# Altium schematic sheet Medicop_Schematic.SchDoc
size A4
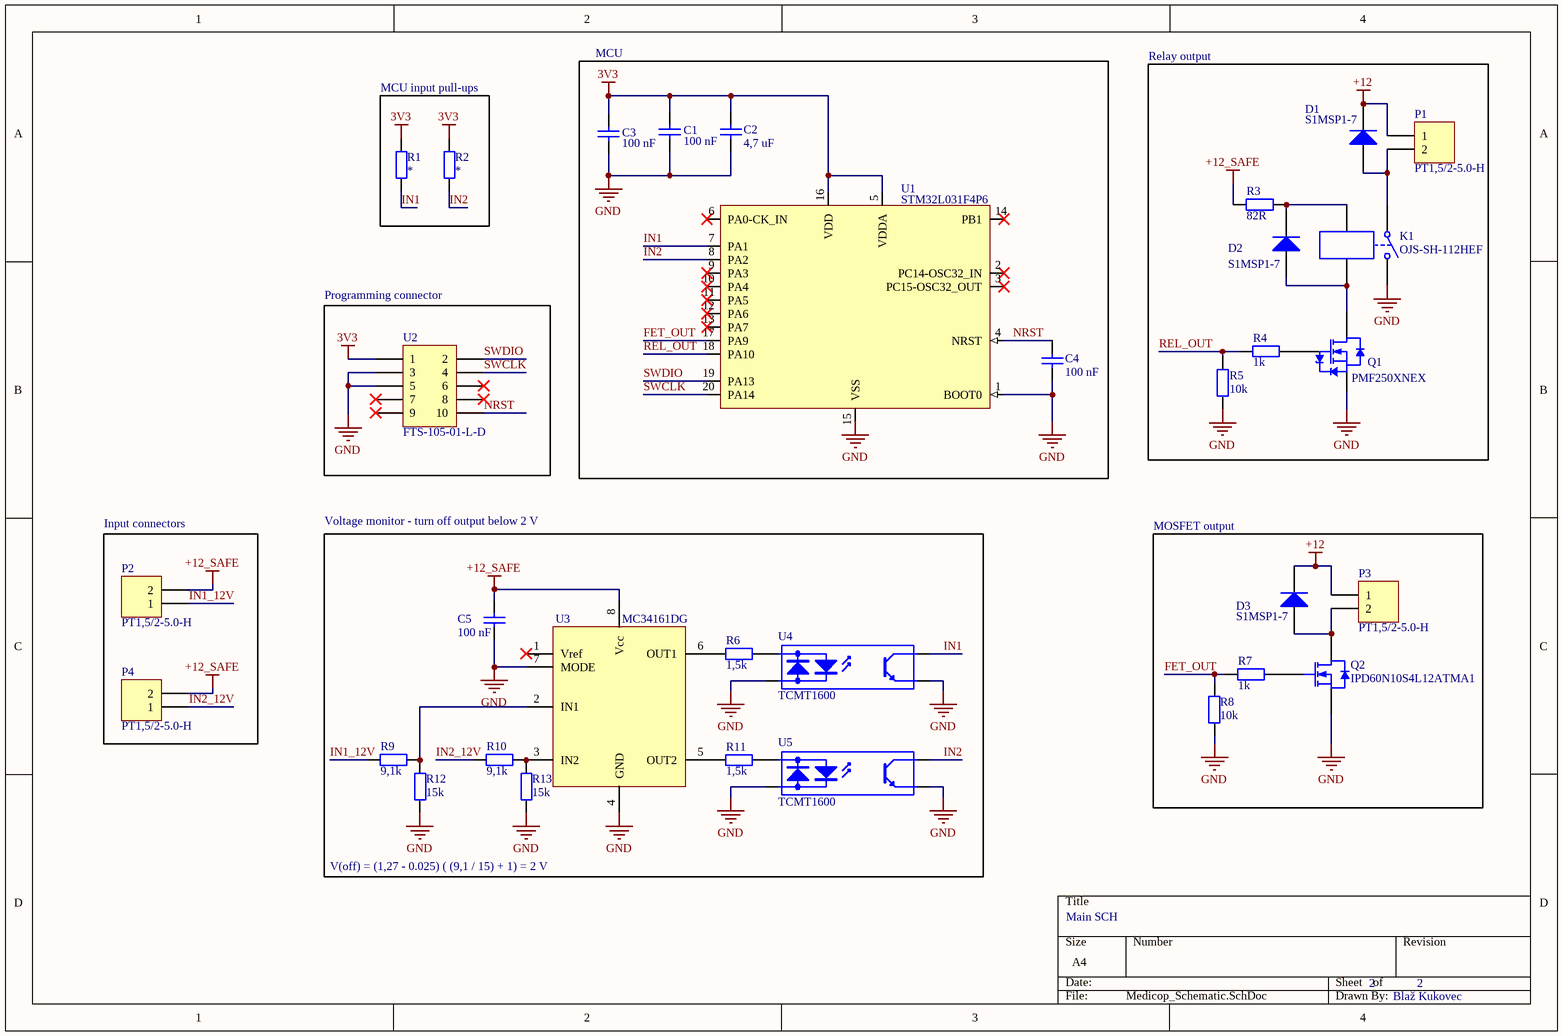
[diagram p0: Medicop_Schematic.SchDoc]

## Parts
C1  value 100 nF  [C0603[1608]]  (hidden comment: Cap)
C2  value 4,7 uF  [C0603[1608]]  (hidden comment: Cap)
C3  value 100 nF  [C0603[1608]]  (hidden comment: Cap)
C4  value 100 nF  [C0603[1608]]  (hidden comment: Cap)
C5  value 100 nF  [C0603[1608]]  (hidden comment: Cap)
D1  S1MSP1-7  [PowerDI123]
D2  S1MSP1-7  [PowerDI123]
D3  S1MSP1-7  [PowerDI123]
K1  OJS-SH-112HEF
P1  PT1,5/2-5.0-H  [PT1,5/2-5.0-H]
P2  PT1,5/2-5.0-H  [PT1,5/2-5.0-H]
P3  PT1,5/2-5.0-H  [PT1,5/2-5.0-H]
P4  PT1,5/2-5.0-H  [PT1,5/2-5.0-H]
Q1  PMF250XNEX  [SC-70 (SOT323)]
Q2  IPD60N10S4L12ATMA1  [DPAK (TO-252)]
R1  Res  [R0603[1608]]  (value not drawn)
R2  Res  [R0603[1608]]  (value not drawn)
R3  value 82R  [R1206[3216]]  (hidden comment: Res)
R4  value 1k  [R0603[1608]]  (hidden comment: Res)
R5  value 10k  [R0603[1608]]  (hidden comment: Res)
R6  value 1,5k  [R1206[3216]]  (hidden comment: Res)
R7  value 1k  [R0603[1608]]  (hidden comment: Res)
R8  value 10k  [R0603[1608]]  (hidden comment: Res)
R9  value 9,1k  [R0603[1608]]  (hidden comment: Res)
R10  value 9,1k  [R0603[1608]]  (hidden comment: Res)
R11  value 1,5k  [R1206[3216]]  (hidden comment: Res)
R12  value 15k  [R0603[1608]]  (hidden comment: Res)
R13  value 15k  [R0603[1608]]  (hidden comment: Res)
U1  STM32L031F4P6  [TSSOP-20]
U2  FTS-105-01-L-D  [CON10_2x5_TU_FTS_SAI]
U3  MC34161DG  [SOIC-8]
U4  TCMT1600  [SOP-4]
U5  TCMT1600  [SOP-4]

## Blocks framed on the sheet
Relay output: D1 D2 K1 P1 Q1 R3-R5
MCU input pull-ups: R1 R2
Programming connector: U2
Input connectors: P2 P4
MOSFET output: D3 P3 Q2 R7 R8

## Nets
3V3: C1.2 C2.2 C3.2 R1.2 R2.2 U1.5(VDDA) U1.16(VDD) U2.1
+12: D1.2(K) D3.2(K) P1.1 P3.1
+12_SAFE: C5.2 P2.2 P4.2 R3.2 U3.8(Vcc)
GND: C1.1 C2.1 C3.1 C4.1 C5.1 K1.2 Q1.2(S) Q2.3(S) R5.1 R8.2 R12.1 R13.1 U1.1(BOOT0) U1.15(VSS) U2.3 U2.5 U3.4(GND) U3.7(MODE) U4.2(K) U4.3(E) U5.2(K) U5.3(E)
FET_OUT: R7.1 R8.1 U1.17(PA9)
IN1: R1.1 U1.7(PA1) U4.4(C)
IN1_12V: P2.1 R9.2
IN2: R2.1 U1.8(PA2) U5.4(C)
IN2_12V: P4.1 R10.2
NRST: C4.2 U1.4(NRST) U2.10
REL_OUT: R4.2 R5.2 U1.18(PA10)
SWCLK: U1.20(PA14) U2.4
SWDIO: U1.19(PA13) U2.2
NetD1_1: D1.1(A) K1.1 P1.2
NetD2_1: D2.1(A) K1.4 Q1.3(D)
NetD2_2: D2.2(K) K1.3 R3.1
NetD3_1: D3.1(A) P3.2 Q2.2(D)
NetQ1_1: Q1.1(G) R4.1
NetQ2_1: Q2.1(G) R7.2
NetR6_1: R6.1 U3.6(OUT1)
NetR6_2: R6.2 U4.1(A)
NetR9_1: R9.1 R12.2 U3.2(IN1)
NetR10_1: R10.1 R13.2 U3.3(IN2)
NetR11_1: R11.1 U3.5(OUT2)
NetR11_2: R11.2 U5.1(A)

Not connected (* = marked no-connect by the designer): U1 2(PC14-OSC32_IN)* 3(PC15-OSC32_OUT)* 6(PA0-CK_IN)* 9(PA3)* 10(PA4)* 11(PA5)* 12(PA6)* 13(PA7)* 14(PB1)*; U2 6* 7* 8* 9*; U3 1(Vref)*

## Notes on the sheet
- MCU
- Voltage monitor - turn off output below 2 V
- V(off) = (1,27 - 0.025) ( (9,1 / 15) + 1) = 2 V
- Main SCH
- 2
- Blaž Kukovec

## Library data of the parts
C1-C5 = Cap: Capacitor; ComponentLink1Description: Supplierlink; ComponentLink2Description: Datasheet
D1-D3 = S1MSP1-7: S1MSP1-7 -  Standard Power Diode; ComponentLink1Description: Supplierlink; PackageDescription: PowerDI123; ComponentLink1URL: http://si.farnell.com/diodes-inc/s1msp1-7/rectifier-single-1kv-1a-powerdi123/dp/2709563?ost=2709563&iscrfnonsku=false&ddkey=http%3Asl-SL%2FElement14_Slovenia%2Fsearch; ComponentLink2Description: Datasheet; ComponentLink2URL: http://www.farnell.com/datasheets/2211407.pdf?_ga=2.218430301.595311603.1510137230-1866036872.1506721459&_gac=1.149546820.1509893228.CjwKCAjw7frPBRBVEiwAuDf_LXlrjw5vBXiuyKtw25GuiPLDKV5cnVdEcFzcF753v9PaBj8Hg6kd-RoC_yYQAvD_BwE; Supplier1: Farnell; SupplierPartNumber1: 2709563
K1 = OJS-SH-112HEF: Power Relay, SPST-NO, 12 VDC, 16 A, OJS, Through Hole, Non Latching; ComponentLink1Description: Supplierlink; PackageDescription: /; ComponentLink1URL: https://si.farnell.com/te-connectivity-oeg/2071556-3/power-relay-spst-no-12vdc-16a/dp/3764768; ComponentLink2Description: Datasheet; ComponentLink2URL: https://www.farnell.com/datasheets/3212368.pdf; Supplier1: Farnell; SupplierPartNumber1: 3764768
P1-P4 = PT1,5/2-5.0-H: Wire-To-Board Terminal Block, 5 mm, 2 Ways, 1.5 mm²; ComponentLink1Description: SupplierLink; ComponentLink1URL: https://si.farnell.com/phoenix-contact/pt1-5-2-5-0-h/terminal-block-wire-to-brd-2pos/dp/1793674?st=pt1,5; ComponentLink2Description: Datasheet; ComponentLink2URL: http://www.farnell.com/datasheets/2325505.pdf; Supplier1: Farnell; SupplierPartNumber1: 1793674
Q1 = PMF250XNEX: Power MOSFET, N Channel, 30 V, 900 mA, 0.212 ohm; ComponentLink1Description: Supplierlink; PackageDescription: SC-70; ComponentLink1URL: https://si.farnell.com/nexperia/pmf250xnex/mosfet-n-ch-30v-0-9a-sc-70/dp/3440055; ComponentLink2Description: Datasheet; ComponentLink2URL: https://4donline.ihs.com/images/VipMasterIC/IC/NEXP/NEXP-S-A0003105620/NEXP-S-A0003100993-1.pdf?hkey=6D3A4C79FDBF58556ACFDE234799DDF0; Supplier1: Farnell; SupplierPartNumber1: 3440055
Q2 = IPD60N10S4L12ATMA1: Power MOSFET, N Channel, 100 V, 60 A, 0.0098 ohm, TO-252 (DPAK), Surface Mount; ComponentLink1Description: Supplierlink; PackageDescription: TO-252 (DPAK); ComponentLink1URL: https://si.farnell.com/infineon/ipd60n10s4l12atma1/mosfet-aec-q101-n-ch-100v-to-252/dp/2725850; ComponentLink2Description: Datasheet; ComponentLink2URL: https://4donline.ihs.com/images/VipMasterIC/IC/INFN/INFNS28006/INFNS28006-1.pdf?hkey=6D3A4C79FDBF58556ACFDE234799DDF0; Supplier1: Farnell; SupplierPartNumber1: 2725850
R1-R13 = Res: Resistor; ComponentLink1Description: Supplierlink; ComponentLink2Description: Datasheet
  R1 R2: Value: *
U1 = STM32L031F4P6: Access line ultra-low-power 32-bit MCU Arm®-based / Cortex®-M0+, up to 32KB Flash, 8KB SRAM, 1KB EEPROM, ADC; ComponentLink1Description: Supplierlink; PackageDescription: TSSOP; ComponentLink1URL: https://si.farnell.com/stmicroelectronics/stm32l031f4p6/mcu-arm-cortex-m0-32mhz-tssop/dp/2770299?gclid=Cj0KCQjwgNanBhDUARIsAAeIcAsvU6dmqvMp5MVE-0sNDLjaUK4LtGccWXp1TXJz6kN2eYlTZZ089QkaAo1SEALw_wcB&mckv=sMuoSKpXF_dc|pcrid|289561886841|kword|stm32l031f4p6|match|p|plid||slid||product||pgrid|35804823499|ptaid|aud-913880707580:kwd-530299959512|&CMP=KNC-GSI-GEN-SKU-G50-STMICROELECTRONICS-0617; ComponentLink2Description: Datasheet; ComponentLink2URL: https://4donline.ihs.com/images/VipMasterIC/IC/SGST/SGST-S-A0002219924/SGST-S-A0002219924-1.pdf?hkey=6D3A4C79FDBF58556ACFDE234799DDF0; Supplier1: Farnell; SupplierPartNumber1: 2770299
U2 = FTS-105-01-L-D: Pin Header, Wire-to-Board, 1.27 mm, 2 Rows, 10 Contacts, Through Hole, FTS; ComponentLink1Description: Supplierlink; PackageDescription: 2x5, 1,27; ComponentLink1URL: https://si.farnell.com/samtec/fts-105-01-l-d/header-1-27mm-thru-hole-10way/dp/1667728; ComponentLink2Description: Datasheet; ComponentLink2URL: https://www.farnell.com/datasheets/2045594.pdf; Supplier1: Farnell; SupplierPartNumber1: 1667728
U3 = MC34161DG: Voltage Monitor, 2 Monitors, 2 V to 40 V Supply, 1.27 V Threshold, Active-Low, MSOP-8; ComponentLink1Description: Supplierlink; PackageDescription: SOIC-8; ComponentLink1URL: https://si.farnell.com/on-semiconductor/mc34161dmr2g/voltage-monitor-1-27v-micro-8/dp/2774746; ComponentLink2Description: Datasheet; ComponentLink2URL: https://4donline.ihs.com/images/VipMasterIC/IC/ONSM/ONSM-S-A0016027427/ONSM-S-A0016015098-1.pdf?hkey=6D3A4C79FDBF58556ACFDE234799DDF0/2001832.pdf; Supplier1: Farnell; SupplierPartNumber1: 2774746
U4 U5 = TCMT1600: ComponentLink1Description: Supplierlink; ComponentLink1URL: http://si.farnell.com/vishay/tcmt1600/optocoupler-transistor-o-p/dp/1469543?st=TCMT1600; ComponentLink2Description: Datasheet; ComponentLink2URL: http://www.farnell.com/datasheets/2049331.pdf?_ga=2.51402858.2976559.1516799392-1866036872.1506721459&_gac=1.247281142.1515412736.Cj0KCQiAyszSBRDJARIsAHAqQ4p5R3qZ2qs70hZPKglejP0cEAb9a5kdz8rr1XWlOilTbtuGZnZjed8aApCDEALw_wcB; Supplier1: Farnell; SupplierPartNumber1: 1469543